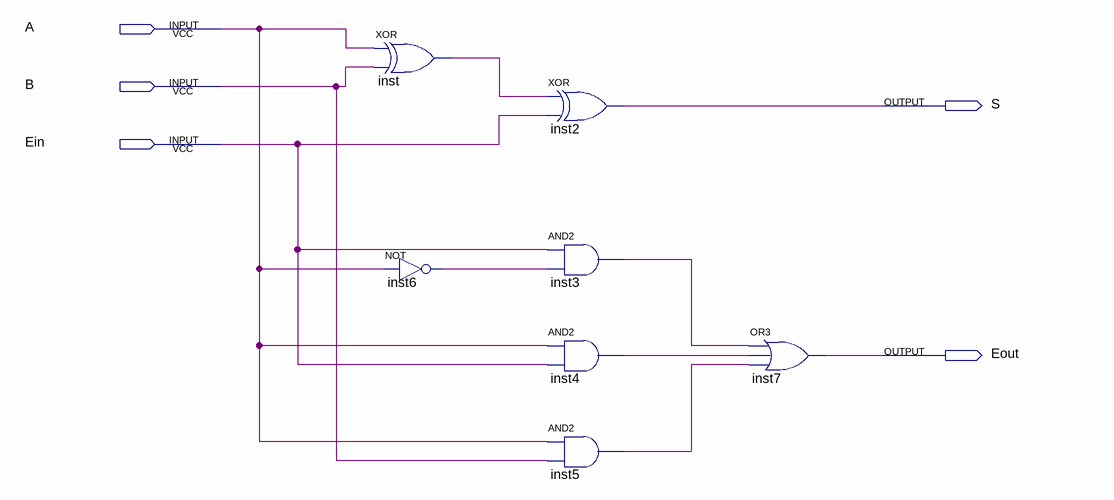
[diagram p0: schematic sheet]
// Quartus schematic unidade_subtracao.bdf as structural Verilog: 7 symbols, 5 pins
module unidade_subtracao (
  input  A,
  input  B,
  input  Ein,
  output S,
  output Eout
);

  wire inst3_out, inst4_out, inst5_out, inst6_out, inst_out;

  xor inst (inst_out, A, B);
  not inst6 (inst6_out, A);
  xor inst2 (S, inst_out, Ein);
  and inst3 (inst3_out, Ein, inst6_out);
  and inst4 (inst4_out, A, Ein);
  and inst5 (inst5_out, A, B);
  or inst7 (Eout, inst3_out, inst4_out, inst5_out);
endmodule
